# EAGLE schematic adc (EAGLE 9.6.2)
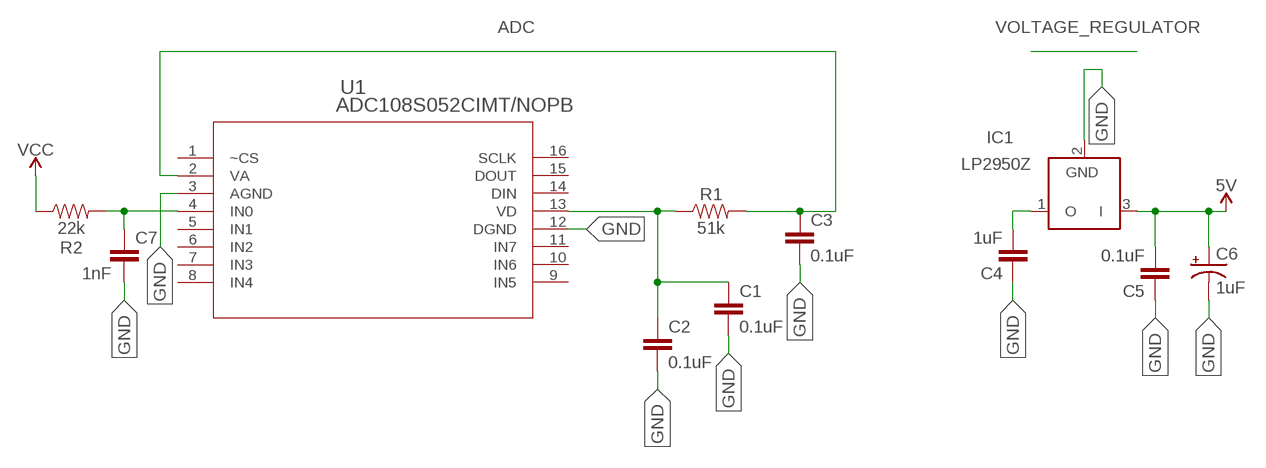
[diagram p0: schematic, sheet 1]

## Parts
C1  0.1uF  CAP-0603  [0603]
C2  0.1uF  CAP-0603  [0603]
C3  0.1uF  CAP-0603  [0603]
C4  1uF  CAP-0603  [0603]
C5  0.1uF  CAP-0603  [0603]
C6  1uF  10UF-POLAR-0603-6.3V-20%(TANT)  [0603-POLAR]
C7  1nF  CAP-0603  [0603]
IC1  LP2950Z  [TO92]
R1  51k  RESISTOR0603  [0603]
R2  22k  RESISTOR0603  [0603]
U1  ADC108S052CIMT/NOPB  [MTC16]

## Nets
5V: C5.2 C6.+ IC1.3(I)
ADC: C3.1 R1.2 U1.2(VA)
GND: C1.2 C2.2 C3.2 C4.1 C5.1 C6.- C7.2 IC1.2(GND) U1.3(AGND) U1.12(DGND)
N$1: C7.1 R2.2 U1.4(IN0)
N$2: C1.1 C2.1 R1.1 U1.13(VD)
N$5: C4.2 IC1.1(O)
VCC: R2.1
Unconnected: U1.1(~CS) U1.5(IN1) U1.6(IN2) U1.7(IN3) U1.8(IN4) U1.9(IN5) U1.10(IN6) U1.11(IN7) U1.14(DIN) U1.15(DOUT) U1.16(SCLK)

## Library data of the parts
C1-C5 C7 = SparkFun-Capacitors:CAP
C6 = SparkFun-Capacitors:10UF-POLAR: 10.0µF polarized capacitors A capacitor is a passive two-terminal electrical component used to store electrical energy temporarily in an electric field.; PROD_ID: CAP-13210; VALUE: 10uF
IC1 = linear:LP2950: 100 mA, Low Power Low Dropout Voltage Regulator Source: http://www.onsemi.com/pub/Collateral/LP2950-D.PDF
R1 R2 = SparkFun-Resistors:RESISTOR: Generic Resistor Package
U1 = custom:ADC108S052CIMT/NOPB; COPYRIGHT: Copyright (C) 2022 Ultra Librarian. All rights reserved.; MANUFACTURER_PART_NUMBER: ADC108S052CIMT/NOPB; MFR_NAME: Texas Instruments; TYPE: ADC108S052CIMT